# Altium schematic sheet 2026-04-05_14-00-001.schdoc
size 246 x 109 mm; SheetNumber: 1; SheetTotal: 1
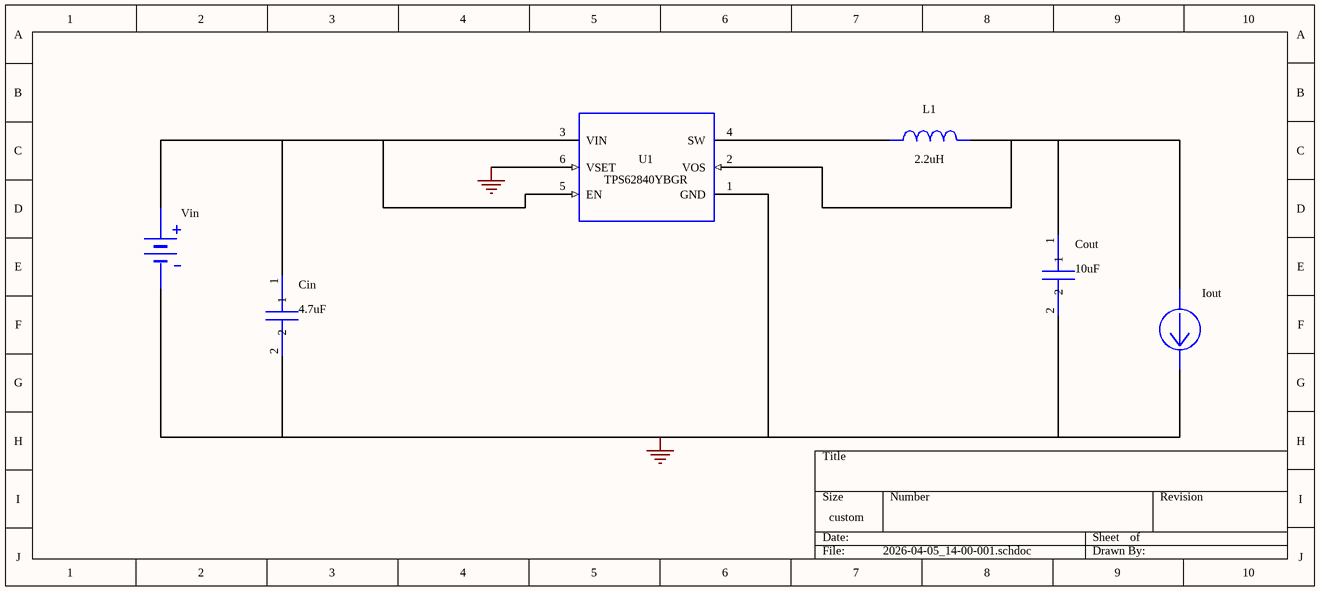
[diagram p0: 2026-04-05_14-00-001.schdoc]

## Parts
Cin  value 4.7uF  (hidden comment: GRM155R60J475ME87D)
Cout  value 10uF  (hidden comment: GRJ155R60J106ME11D)
Iout  WB_CURRENT_LOAD  (value not drawn)
L1  value 2.2uH  (hidden comment: DFE201612E-2R2M=P2)
U1  TPS62840YBGR
Vin  WB_BATTERY  (value not drawn)

## Nets
0: Cin.2 Cout.2 Iout.2(-) U1.1(GND) U1.6(VSET) Vin.2(-)
NetCin_1: Cin.1 U1.3(VIN) U1.5(EN) Vin.1(+)
NetCout_1: Cout.1 Iout.1(+) L1.1 U1.2(VOS)
NetL1_2: L1.2 U1.4(SW)

## Library data of the parts
Cin = GRM155R60J475ME87D: GRM155R60J475ME8; Manufacturer Name: MuRata; PackageReference: GRM155R60J475ME87D; Manufacturer Part Number: GRM155R60J475ME87D
Cout = GRJ155R60J106ME11D: GRJ155R60J106ME1; Manufacturer Name: MuRata; PackageReference: GRJ155R60J106ME11D; Manufacturer Part Number: GRJ155R60J106ME11D
L1 = DFE201612E-2R2M=P2: DFE201612E-2R2M=; Manufacturer Name: MuRata; PackageReference: DFE201612E-2R2M=P2; Manufacturer Part Number: DFE201612E-2R2M=P2
U1 = TPS62840YBGR: Manufacturer Name: Texas Instruments; PackageReference: TPS62840YBGR; Manufacturer Part Number: TPS62840YBGR; Value: N/A
Iout = WB_CURRENT_LOAD: PackageReference: WB_CURRENT_LOAD; Manufacturer Part Number: WB_CURRENT_LOAD; Manufacturer Name: WB_CURRENT_LOAD; Value: N/A
Vin = WB_BATTERY: PackageReference: WB_BATTERY; Manufacturer Part Number: WB_BATTERY; Manufacturer Name: WB_BATTERY; Value: N/A